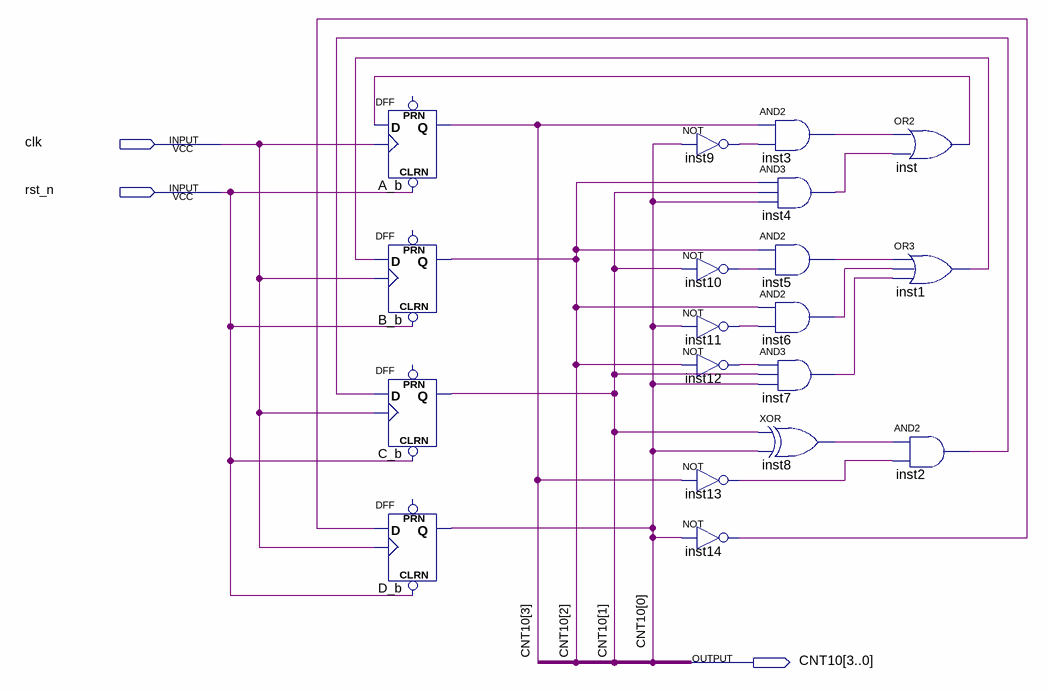
[diagram p0: schematic sheet]
// Quartus schematic count10.bdf as structural Verilog: 19 symbols, 3 pins
module count10 (
  input  clk,
  input  rst_n,
  output [3:0] CNT10
);

  wire inst1_out, inst2_out, inst3_out, inst4_out, inst5_out, inst6_out, inst7_out, inst8_out, inst9_out,
       inst10_out, inst11_out, inst12_out, inst13_out, inst14_out, inst_out;

  DFF A_b (.CLRN(rst_n), .CLK(clk), .D(inst_out), .Q(CNT10[3]));  // open: PRN
  DFF B_b (.CLRN(rst_n), .CLK(clk), .D(inst1_out), .Q(CNT10[2]));  // open: PRN
  DFF C_b (.CLRN(rst_n), .CLK(clk), .D(inst2_out), .Q(CNT10[1]));  // open: PRN
  DFF D_b (.CLRN(rst_n), .CLK(clk), .D(inst14_out), .Q(CNT10[0]));  // open: PRN
  not inst9 (inst9_out, CNT10[0]);
  not inst10 (inst10_out, CNT10[1]);
  not inst11 (inst11_out, CNT10[0]);
  not inst12 (inst12_out, CNT10[2]);
  not inst13 (inst13_out, CNT10[3]);
  not inst14 (inst14_out, CNT10[0]);
  and inst3 (inst3_out, CNT10[3], inst9_out);
  and inst4 (inst4_out, CNT10[2], CNT10[1], CNT10[0]);
  and inst5 (inst5_out, CNT10[2], inst10_out);
  and inst6 (inst6_out, CNT10[2], inst11_out);
  and inst7 (inst7_out, inst12_out, CNT10[1], CNT10[0]);
  xor inst8 (inst8_out, CNT10[1], CNT10[0]);
  or inst (inst_out, inst3_out, inst4_out);
  or inst1 (inst1_out, inst5_out, inst6_out, inst7_out);
  and inst2 (inst2_out, inst8_out, inst13_out);
endmodule
